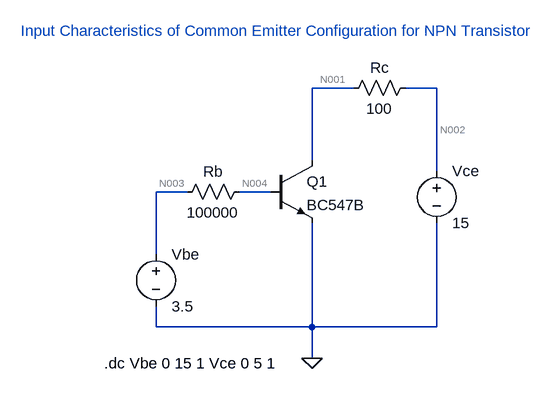
[diagram p0: schematic Assignment 5a (i).asc]
Assignment 5a (i).asc, the LTspice schematic file:
Version 4
SHEET 1 880 680
WIRE 336 -32 272 -32
WIRE 464 -32 416 -32
WIRE 272 80 272 -32
WIRE 464 96 464 -32
WIRE 80 128 32 128
WIRE 208 128 160 128
WIRE 32 224 32 128
WIRE 32 336 32 304
WIRE 272 336 272 176
WIRE 272 336 32 336
WIRE 464 336 464 176
WIRE 464 336 272 336
WIRE 272 384 272 336
FLAG 272 384 0
SYMBOL voltage 32 208 R0
WINDOW 123 0 0 Left 2
WINDOW 39 0 0 Left 2
SYMATTR InstName Vbe
SYMATTR Value 3.5
SYMBOL voltage 464 80 R0
WINDOW 123 0 0 Left 2
WINDOW 39 0 0 Left 2
SYMATTR InstName Vce
SYMATTR Value 15
SYMBOL res 176 112 R90
WINDOW 0 0 56 VBottom 2
WINDOW 3 32 56 VTop 2
SYMATTR InstName Rb
SYMATTR Value 100000
SYMBOL npn 208 80 R0
SYMATTR InstName Q1
SYMATTR Value BC547B
SYMBOL res 432 -48 R90
WINDOW 0 0 56 VBottom 2
WINDOW 3 32 56 VTop 2
SYMATTR InstName Rc
SYMATTR Value 100
TEXT -176 -120 Left 2 ;Input Characteristics of Common Emitter Configuration for NPN Transistor
TEXT -48 392 Left 2 !.dc Vbe 0 15 1 Vce 0 5 1

The netlist it stands for:
* Assignment 5a (i).asc
Vbe N003 0 3.5
Vce N002 0 15
Rb N004 N003 100000
Q1 N001 N004 0 0 BC547B
Rc N002 N001 100
.model NPN NPN
.model PNP PNP
.lib standard.bjt
* Input Characteristics of Common Emitter Configuration for NPN Transistor
.dc Vbe 0 15 1 Vce 0 5 1
.backanno
.end

* Results of the author's LTspice run, read from the files saved beside the schematic
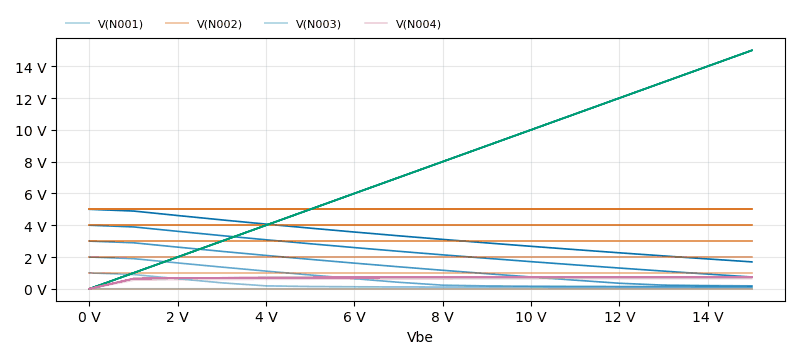
[diagram p1: DC transfer characteristic of Assignment 5a (i).asc, plotted from the saved traces]
* DC transfer characteristic, 6 runs:
*   V(N001) [Vce=0]: 0 V at Vbe=0 V, 5.034 mV at Vbe=15 V, min 0 V, max 5.034 mV
*   V(N001) [Vce=1]: 1 V at Vbe=0 V, 86.75 mV at Vbe=15 V, min 86.75 mV, max 1 V
*   V(N001) [Vce=2]: 2 V at Vbe=0 V, 131.2 mV at Vbe=15 V, min 131.2 mV, max 2 V
*   V(N001) [Vce=3]: 3 V at Vbe=0 V, 186.1 mV at Vbe=15 V, min 186.1 mV, max 3 V
*   V(N001) [Vce=4]: 4 V at Vbe=0 V, 743 mV at Vbe=15 V, min 743 mV, max 4 V
*   V(N001) [Vce=5]: 5 V at Vbe=0 V, 1.693 V at Vbe=15 V, min 1.693 V, max 5 V
*   V(N002) [Vce=0]: 0 V at Vbe=0 V, 0 V at Vbe=15 V, min 0 V, max 0 V
*   V(N002) [Vce=1]: 1 V at Vbe=0 V, 1 V at Vbe=15 V, min 1 V, max 1 V
*   V(N002) [Vce=2]: 2 V at Vbe=0 V, 2 V at Vbe=15 V, min 2 V, max 2 V
*   V(N002) [Vce=3]: 3 V at Vbe=0 V, 3 V at Vbe=15 V, min 3 V, max 3 V
*   V(N002) [Vce=4]: 4 V at Vbe=0 V, 4 V at Vbe=15 V, min 4 V, max 4 V
*   V(N002) [Vce=5]: 5 V at Vbe=0 V, 5 V at Vbe=15 V, min 5 V, max 5 V
*   V(N003) [Vce=0]: 0 V at Vbe=0 V, 15 V at Vbe=15 V, min 0 V, max 15 V
*   V(N003) [Vce=1]: 0 V at Vbe=0 V, 15 V at Vbe=15 V, min 0 V, max 15 V
*   V(N003) [Vce=2]: 0 V at Vbe=0 V, 15 V at Vbe=15 V, min 0 V, max 15 V
*   V(N003) [Vce=3]: 0 V at Vbe=0 V, 15 V at Vbe=15 V, min 0 V, max 15 V
*   V(N003) [Vce=4]: 0 V at Vbe=0 V, 15 V at Vbe=15 V, min 0 V, max 15 V
*   V(N003) [Vce=5]: 0 V at Vbe=0 V, 15 V at Vbe=15 V, min 0 V, max 15 V
*   V(N004) [Vce=0]: 0 V at Vbe=0 V, 638.6 mV at Vbe=15 V, min 0 V, max 638.6 mV
*   V(N004) [Vce=1]: -35.35 nV at Vbe=0 V, 704.8 mV at Vbe=15 V, min -35.35 nV, max 704.8 mV
*   V(N004) [Vce=2]: 64.65 nV at Vbe=0 V, 728.1 mV at Vbe=15 V, min 64.65 nV, max 728.1 mV
*   V(N004) [Vce=3]: 164.6 nV at Vbe=0 V, 744.3 mV at Vbe=15 V, min 164.6 nV, max 744.3 mV
*   V(N004) [Vce=4]: 264.6 nV at Vbe=0 V, 750.4 mV at Vbe=15 V, min 264.6 nV, max 750.4 mV
*   V(N004) [Vce=5]: 364.6 nV at Vbe=0 V, 750.7 mV at Vbe=15 V, min 364.6 nV, max 750.7 mV